# EAGLE design BMS-banana-rev1-0 (EAGLE 9.6.2)
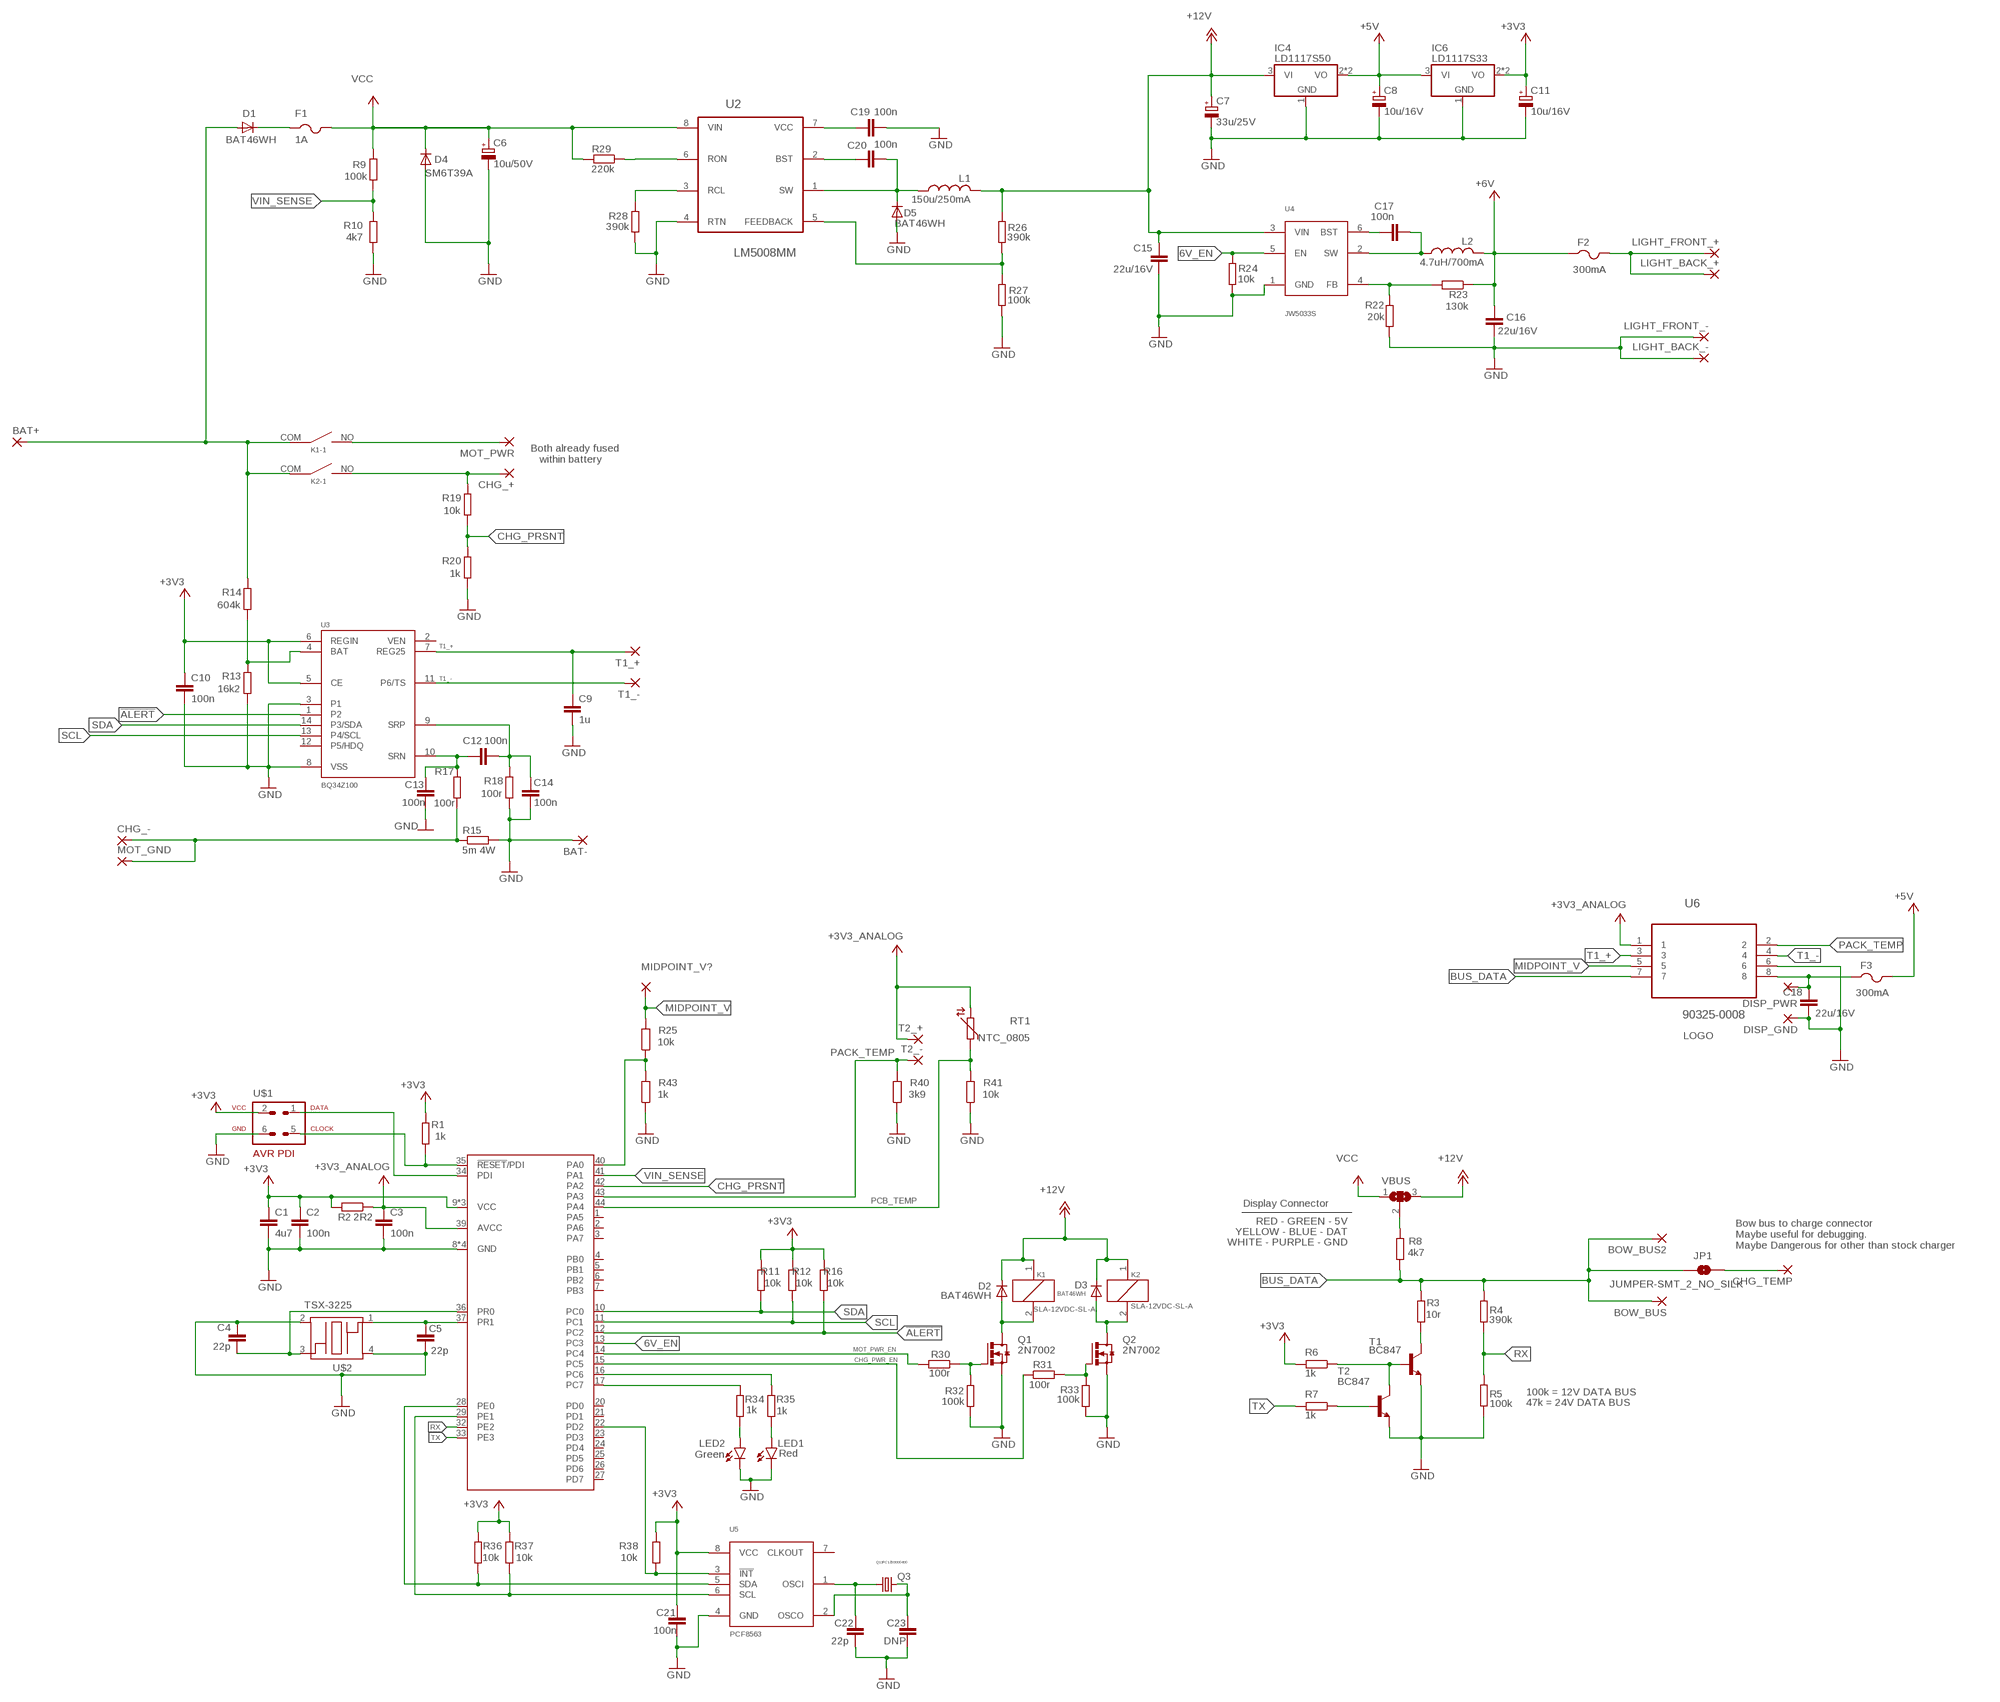
[diagram p0: schematic, sheet 1]

## Parts
BAT+  3,81/2,1  [3,81/2,1]
BAT-  3,81/2,1  [3,81/2,1]
BOW_BUS  3,81/2,1  [3,81/2,1]
BOW_BUS2  2,54/0,8  [2,54/0,8]
C1  4u7  C-EUC0805  [C0805]
C2  100n  C-EUC0805  [C0805]
C3  100n  C-EUC0805  [C0805]
C4  22p  C-EUC0805  [C0805]
C5  22p  C-EUC0805  [C0805]
C6  10u/50V  CPOL-EU153CLV-0605  [153CLV-0605]
C7  33u/25V  CPOL-EU153CLV-0605  [153CLV-0605]
C8  10u/16V  CPOL-EU153CLV-0405  [153CLV-0405]
C9  1u  C-EUC0805  [C0805]
C10  100n  C-EUC0805  [C0805]
C11  10u/16V  CPOL-EU153CLV-0405  [153CLV-0405]
C12  100n  C-EUC0805  [C0805]
C13  100n  C-EUC0805  [C0805]
C14  100n  C-EUC0805  [C0805]
C15  22u/16V  C-EUC0805  [C0805]
C16  22u/16V  C-EUC0805  [C0805]
C17  100n  C-EUC0805  [C0805]
C18  22u/16V  C-EUC0805  [C0805]
C19  100n  C-EUC0805  [C0805]
C20  100n  C-EUC0805  [C0805]
C21  100n  C-EUC0805  [C0805]
C22  22p  C-EUC0805  [C0805]
C23  DNP  C-EUC0805  [C0805]
CHG_+  3,81/2,1  [3,81/2,1]
CHG_-  3,81/2,1  [3,81/2,1]
CHG_TEMP  3,81/2,1  [3,81/2,1]
D1  BAT46WH  DIODE-SMB  [SMB]
D2  BAT46WH  DIODE-SMB  [SMB]
D3  BAT46WH  DIODE-SMB  [SMB]
D4  SM6T39A  DIODE-SMB  [SMB]
D5  BAT46WH  DIODE-SOD323-W  [SOD323-W]
DISP_GND  2,54/0,8  [2,54/0,8]
DISP_PWR  2,54/0,8  [2,54/0,8]
F1  1A  PTCFUSE-1812  [1812]
F2  300mA  PTCFUSE-1812  [1812]
F3  300mA  PTCFUSE-1812  [1812]
IC4  LD1117S50  LM340ST-ST  [SOT223]
IC6  LD1117S33  LM340ST-ST  [SOT223]
JP1  JUMPER-SMT_2_NO_SILK  [SMT-JUMPER_2_NO_SILK]
K1  SLA-12VDC-SL-A  [SLA-12VDC-SL-A]
K2  SLA-12VDC-SL-A  [SLA-12VDC-SL-A]
L1  150u/250mA  L-USWE-TPC  [POWER-CHOKE_WE-TPC]
L2  4.7uH/700mA  L_0805  [L0805]
LED1  Red  LEDCHIPLED_0805  [CHIPLED_0805]
LED2  Green  LEDCHIPLED_0805  [CHIPLED_0805]
LIGHT_BACK_+  2,54/0,8  [2,54/0,8]
LIGHT_BACK_-  2,54/0,8  [2,54/0,8]
LIGHT_FRONT_+  2,54/0,8  [2,54/0,8]
LIGHT_FRONT_-  2,54/0,8  [2,54/0,8]
MIDPOINT_V?  2,54/0,8  [2,54/0,8]
MOT_GND  3,81/2,1  [3,81/2,1]
MOT_PWR  3,81/2,1  [3,81/2,1]
Q1  2N7002  [SOT-23]
Q2  2N7002  [SOT-23]
Q3  Q13FC1350000400  [CRYSTAL_3215]
R1  1k  R-EU_R0805  [R0805]
R2  2R2  R-EU_R0805  [R0805]
R3  10r  R-EU_R0805  [R0805]
R4  390k  R-EU_R0805  [R0805]
R5  100k  R-EU_R0805  [R0805]
R6  1k  R-EU_R0805  [R0805]
R7  1k  R-EU_R0805  [R0805]
R8  4k7  R-EU_R0805  [R0805]
R9  100k  R-EU_R0805  [R0805]
R10  4k7  R-EU_R0805  [R0805]
R11  10k  R-EU_R0805  [R0805]
R12  10k  R-EU_R0805  [R0805]
R13  16k2  R-EU_R0805  [R0805]
R14  604k  R-EU_R0805  [R0805]
R15  5m 4W  SHUNT_2728  [R2728]
R16  10k  R-EU_R0805  [R0805]
R17  100r  R-EU_R0805  [R0805]
R18  100r  R-EU_R0805  [R0805]
R19  10k  R-EU_R0805  [R0805]
R20  1k  R-EU_R0805  [R0805]
R22  20k  R-EU_R0805  [R0805]
R23  130k  R-EU_R0805  [R0805]
R24  10k  R-EU_R0805  [R0805]
R25  10k  R-EU_R0805  [R0805]
R26  390k  R-EU_R0805  [R0805]
R27  100k  R-EU_R0805  [R0805]
R28  390k  R-EU_R0805  [R0805]
R29  220k  R-EU_R0805  [R0805]
R30  100r  R-EU_R0805  [R0805]
R31  100r  R-EU_R0805  [R0805]
R32  100k  R-EU_R0805  [R0805]
R33  100k  R-EU_R0805  [R0805]
R34  1k  R-EU_R0805  [R0805]
R35  1k  R-EU_R0805  [R0805]
R36  10k  R-EU_R0805  [R0805]
R37  10k  R-EU_R0805  [R0805]
R38  10k  R-EU_R0805  [R0805]
R40  3k9  R-EU_R0805  [R0805]
R41  10k  R-EU_R0805  [R0805]
R43  1k  R-EU_R0805  [R0805]
RT1  NTC_0805  [R0805]
T1  BC847  [SOT23]
T1_+  2,54/0,8  [2,54/0,8]
T1_-  2,54/0,8  [2,54/0,8]
T2  BC847  [SOT23]
T2_+  2,54/0,8  [2,54/0,8]
T2_-  2,54/0,8  [2,54/0,8]
U1  ATXMEGA32A4U-AU  [TQFP-44A-44]
U2  LM5008MM  [SOP65P490X109-8N]
U3  BQ34Z100  [PW_R-PDSO-G14]
U4  JW5033S  [SOT23-6]
U5  PCF8563  [SO08]
U6  90325-0008  [MOLEX_90325-0008]
U$1  AVR-PDIVERT  [AVR-ISP-6]
U$2  TSX-3225  [TSX-3225]
U$4  AFROBOTICLOGOAFROBOTICLOGO_SMALL  [AFROBOTICLOGOSMALL]
VBUS  SJ2W  [SJ_2]

## Nets
6V_EN: R24.2 U1.13(PC3) U4.5(EN)
!ALERT: R16.1 U1.12(PC2) U3.1(P2)
+3V3: C1.1 C2.1 C10.1 C11.+ C21.2 IC6.2(VO) IC6.4(VO) R1.2 R2.2 R6.2 R11.2 R12.2 R16.2 R36.2 R37.2 R38.2 U1.9(VCC) U1.19(VCC) U1.31(VCC) U3.5(CE) U3.6(REGIN) U5.8(VCC) U$1.2
+3V3_ANALOG: C3.1 R2.1 RT1.2 T2_+.1(P) U1.39(AVCC) U6.1
+5V: C8.+ F3.2 IC4.2(VO) IC4.4(VO) IC6.3(VI)
+6V: C16.2 F2.1 L2.2 R23.1
+12V: C7.+ C15.2 D2.C D3.C IC4.3(VI) K1.1 K2.1 L1.2 R26.2 U4.3(VIN) VBUS.3
BUS_DATA: BOW_BUS2.1(P) BOW_BUS.1(P) JP1.1 R3.2 R4.2 R8.1 U6.7
CHG_PRSNT: R19.1 R20.2 U1.42(PA2)
CHG_PWR_EN: R31.1 U1.15(PC5)
GND: BAT-.1(P) C1.2 C2.2 C3.2 C4.1 C5.2 C6.- C7.- C8.- C9.2 C10.2 C11.- C13.1 C14.1 C15.1 C16.1 C18.1 C19.2 C21.1 C22.1 C23.1 D4.A D5.A DISP_GND.1(P) IC4.1(GND) IC6.1(GND) LED1.C LED2.C LIGHT_BACK_-.1(P) LIGHT_FRONT_-.1(P) Q1.2(S) Q2.2(S) R5.1 R10.1 R13.1 R15.P$2 R18.1 R20.1 R22.1 R24.1 R27.1 R28.1 R32.2 R33.2 R40.1 R41.1 R43.1 T1.2(E) T2.2(E) U1.8(GND) U1.18(GND) U1.30(GND) U1.38(GND) U2.4(RTN) U3.3(P1) U3.8(VSS) U4.1(GND) U5.4(GND) U6.6 U$1.6 U$2.2(GND_2) U$2.4(GND_4)
MIDPOINT_V: MIDPOINT_V?.1(P) R25.2 U6.5
MOT_PWR_EN: R30.2 U1.14(PC4)
N$1: R1.1 U1.35(!RESET!/PDI) U$1.5
N$2: U1.34(PDI) U$1.1
N$3: D1.C F1.1
N$4: C5.1 U1.37(PR1) U$2.1(XTALIN)
N$5: C4.2 U1.36(PR0) U$2.3(XTALOUT)
N$6: R8.2 VBUS.2
N$7: C19.1 U2.7(VCC)
N$8: R13.2 R14.1 U3.4(BAT)
N$10: R22.2 R23.2 U4.4(FB)
N$11: CHG_-.1(P) MOT_GND.1(P) R15.P$1 R17.1
N$12: R3.1 T1.3(C)
N$14: C12.1 C13.2 R17.2 U3.10(SRN)
N$15: CHG_+.1(P) K2.NO(-1:NO) R19.2
N$16: C12.2 C14.2 R18.2 U3.9(SRP)
N$17: C20.1 U2.2(BST)
N$18: K1.NO(-1:NO) MOT_PWR.1(P)
N$19: CHG_TEMP.1(P) JP1.2
N$20: F2.2 LIGHT_BACK_+.1(P) LIGHT_FRONT_+.1(P)
N$21: C18.2 DISP_PWR.1(P) F3.1 U6.8
N$22: C20.2 D5.C L1.1 U2.1(SW)
N$23: R7.1 T2.1(B)
N$24: R26.1 R27.2 U2.5(FEEDBACK)
N$25: R6.1 T1.1(B) T2.3(C)
N$26: C17.1 U4.6(BST)
N$27: R28.2 U2.3(RCL)
N$28: C17.2 L2.1 U4.2(SW)
N$29: R25.1 R43.2 U1.40(PA0)
N$30: R29.1 U2.6(RON)
N$31: Q1.1(G) R30.1 R32.1
N$32: D2.A K1.2 Q1.3(D)
N$33: R38.1 U1.22(PD2) U5.3(!INT)
N$34: D3.A K2.2 Q2.3(D)
N$35: Q2.1(G) R31.2 R33.1
N$36: LED2.A R34.1
N$37: R37.1 U1.29(PE1) U5.6(SCL)
N$38: LED1.A R35.1
N$39: R35.2 U1.16(PC6)
N$40: R34.2 U1.17(PC7)
N$41: R36.1 U1.28(PE0) U5.5(SDA)
N$42: C22.2 Q3.P$1 U5.1(OSCI)
N$43: C23.2 Q3.P$2 U5.2(OSCO)
PACK_TEMP: R40.2 T2_-.1(P) U1.43(PA3) U6.2
PCB_TEMP: R41.2 RT1.1 U1.44(PA4)
RX: R4.1 R5.2 U1.32(PE2)
SCL: R12.1 U1.11(PC1) U3.13(P4/SCL)
SDA: R11.1 U1.10(PC0) U3.14(P3/SDA)
T1_+: C9.1 T1_+.1(P) U3.7(REG25) U6.3
T1_-: T1_-.1(P) U3.11(P6/TS) U6.4
TX: R7.2 U1.33(PE3)
VBAT: BAT+.1(P) D1.A K1.COM(-1:COM) K2.COM(-1:COM) R14.2
VCC: C6.+ D4.C F1.2 R9.2 R29.2 U2.8(VIN) VBUS.1
VIN_SENSE: R9.1 R10.2 U1.41(PA1)
Unconnected: U1.1(PA5) U1.2(PA6) U1.3(PA7) U1.4(PB0) U1.5(PB1) U1.6(PB2) U1.7(PB3) U1.20(PD0) U1.21(PD1) U1.23(PD3) U1.24(PD4) U1.25(PD5) U1.26(PD6) U1.27(PD7) U3.2(VEN) U3.12(P5/HDQ) U5.7(CLKOUT)

## Notes on the sheet
- Both already fused
     within battery
- Display Connector
- RED - GREEN - 5V
- YELLOW - BLUE - DAT
- WHITE - PURPLE - GND
- Bow bus to charge connector
  Maybe useful for debugging.
  Maybe Dangerous for other than stock charger
- 100k = 12V DATA BUS
- 47k = 24V DATA BUS

## Library data of the parts
BAT+ BAT- BOW_BUS CHG_+ CHG_- CHG_TEMP MOT_GND MOT_PWR = thierry:3,81/2,1: THROUGH-HOLE PAD
BOW_BUS2 DISP_GND DISP_PWR LIGHT_BACK_+ LIGHT_BACK_- LIGHT_FRONT_+ LIGHT_FRONT_- MIDPOINT_V? T1_+ T1_- T2_+ T2_- = thierry:2,54/0,8: THROUGH-HOLE PAD
C1-C5 C9 C10 C12-C23 = rcl:C-EU: CAPACITOR, European symbol; SPICEPREFIX: C
C6-C8 C11 = rcl:CPOL-EU: POLARIZED CAPACITOR, European symbol
D1-D3 = diode:DIODE-: DIODE; FARNELL: 2069340
D4 = diode:DIODE-: DIODE; FARNELL: 9802703
D5 = diode:DIODE-: DIODE
F1-F3 = adafruit:PTCFUSE: PTC fuses, resettable thermistors
IC4 = linear:LM340?-*: Positive VOLTAGE REGULATOR Source: http://cache.national.com/ds/LM/LM340.pdf; FARNELL: 1467780
IC6 = linear:LM340?-*: Positive VOLTAGE REGULATOR Source: http://cache.national.com/ds/LM/LM340.pdf
JP1 = SparkFun-Jumpers:JUMPER-SMT_2_NO: Normally open jumper This jumper has two pads in close proximity to each other. Apply solder to close the connection. Round pads are easier to solder for beginners, but are a lot larger. SparkFun Product that uses the round pads: SparkFun EL Sequencer <https://www.sparkfun.com/products/12781>
K1 K2 = thierry:SLA-12VDC-SL-A; LSCS: C55194
L1 = rcl:L-US: INDUCTOR, American symbol
L2 = thierry:L_0805
LED1 LED2 = led:LED: LED OSRAM: - CHIPLED LG R971, LG N971, LY N971, LG Q971, LY Q971, LO R971, LY R971 LH N974, LH R974 LS Q976, LO Q976, LY Q976 LO Q996 - Hyper CHIPLED LW Q18S LB Q993, LB Q99A, LB R99A - SideLED LS A670, LO A670, LY A670, LG A670, LP A670 LB A673, LV A673, LT A673, LW A673 LH A674 LY A675 LS A676, LA A676, LO A676, LY A676, LW A676 LS A679, LY A679, LG A679 - Hyper Micro SIDELED® LS Y876, LA Y876, LO Y876, LY Y876 LT Y87S - SmartLED LW L88C, LW L88S LB L89C, LB L89S, LG L890 LS L89K, LO L89K, LY L89K LS L896, LA L896, LO L896, LY L896 - TOPLED LS T670, LO T670, LY T670, LG T670, LP T670 LSG T670, LSP T670, LSY T670, LOP T670, LYG T670 LG T671, LOG T671, LSG T671 LB T673, LV T673, LT T673, LW T673 LH T674 LS T676, LA T676, LO T676, LY T676, LB T676, LH T676, LSB T676, LW T676 LB T67C, LV T67C, LT T67C, LS T67K, LO T67K, LY T67K, LW E67C LS E67B, LA E67B, LO E67B, LY E67B, LB E67C, LV E67C, LT E67C LW T67C LS T679, LY T679, LG T679 LS T770, LO T770, LY T770, LG T770, LP T770 LB T773, LV T773, LT T773, LW T773 LH T774 LS E675, LA E675, LY E675, LS T675 LS T776, LA T776, LO T776, LY T776, LB T776 LHGB T686 LT T68C, LB T68C - Hyper Mini TOPLED® LB M676 - Mini TOPLED Santana® LG M470 LS M47K, LO M47K, LY M47K Source: http://www.osram.convergy.de LUXEON: - LUMILED® LXK2-PW12-R00, LXK2-PW12-S00, LXK2-PW14-U00, LXK2-PW14-V00 LXK2-PM12-R00, LXK2-PM12-S00, LXK2-PM14-U00 LXK2-PE12-Q00, LXK2-PE12-R00, LXK2-PE12-S00, LXK2-PE14-T00, LXK2-PE14-U00 LXK2-PB12-K00, LXK2-PB12-L00, LXK2-PB12-M00, LXK2-PB14-N00, LXK2-PB14-P00, LXK2-PB14-Q00 LXK2-PR12-L00, LXK2-PR12-M00, LXK2-PR14-Q00, LXK2-PR14-R00 LXK2-PD12-Q00, LXK2-PD12-R00, LXK2-PD12-S00 LXK2-PH12-R00, LXK2-PH12-S00 LXK2-PL12-P00, LXK2-PL12-Q00, LXK2-PL12-R00 Source: www.luxeon.com KINGBRIGHT: KA-3528ASYC Source: www.kingbright.com
Q1 Q2 = thierry:2N7002
Q3 = thierry:Q13FC1350000400; LCSC: C32346
R1-R14 R16-R20 R22-R38 R40 R41 R43 = rcl:R-EU_: RESISTOR, European symbol; SPICEPREFIX: R
R15 = thierry:SHUNT_2728
RT1 = thierry:NTC_0805
T1 T2 = transistor:BC847: NPN TRANSISTOR
U1 = atmel-xmega:ATXMEGA32A4U: 8/16-bit XMEGA A4U Microcontroller Features High-performance, low-power Atmel® AVR® XMEGA® 8/16-bit Microcontroller Nonvolatile program and data memories – 16K - 128KBytes of in-system self-programmable flash – 4K - 8KBytes boot section – 1K - 2KBytes EEPROM – 2K - 8KBytes internal SRAM Peripheral Features – Four-channel DMA controller – Eight-channel event system – Five 16-bit timer/counters Three timer/counters with 4 output compare or input capture channels Two timer/counters with 2 output compare or input capture channels High-resolution extensions on all timer/counters Advanced waveform extension (AWeX) on one timer/counter – One USB device interface USB 2.0 full speed (12Mbps) and low speed (1.5Mbps) device compliant 32 Endpoints with full configuration flexibility – Five USARTs with IrDA support for one USART – Two Two-wire interfaces with dual address match (I2C and SMBus compatible) – Two serial peripheral interfaces (SPIs) – AES and DES crypto engine – CRC-16 (CRC-CCITT) and CRC-32 (IEEE® 802.3) generator – 16-bit real time counter (RTC) with separate oscillator – One twelve-channel, 12-bit, 2mspsAnalog to Digital Converter – One two-channel, 12-bit, 1msps Digital to Analog Converter – Two Analog Comparators with window compare function, and current sources – External interrupts on all general purpose I/O pins – Programmable watchdog timer with separate on-chip ultra low power oscillator – QTouch® library support Capacitive touch buttons, sliders and wheels Special microcontroller features – Power-on reset and programmable brown-out detection – Internal and external clock options with PLL and prescaler – Programmable multilevel interrupt controller – Five sleep modes – Programming and debug interfaces PDI (program and debug interface) I/O and packages – 34 Programmable I/O pins – 44 - lead TQFP – 44 - pad VQFN/QFN – 49 - ball VFBGA Operating voltage – 1.6 – 3.6V Operating frequency – 0 – 12MHz from 1.6V – 0 – 32MHz from 2.7V
U2 = components:LM5008MM: Step-Down Switching Regulator; MPN: LM5008MM; OC_FARNELL: 8181721; OC_NEWARK: 38K3760; PACKAGE: SOP-8; SUPPLIER: National Semiconductor
U3 = borkedlabs-powerics:BQ34Z100
U4 = thierry:JW5033S; LCSC: C324577
U5 = thierry:PCF8563; LCSC: C7440
U6 = Molex_By_element14_Batch_1:90325-0008: HEADER; MPN: 90325-0008; OC_FARNELL: 673237; OC_NEWARK: 46WX960; PACKAGE: HEADER, 1.27MM, 8 WAY; SUPPLIER: Molex
U$1 = avr-7:AVR-PDI: AVR PDI programming interface connector
U$2 = crystals:TSX-3225
U$4 = thierry:AFROBOTICLOGO
VBUS = jumper:SJ2W: SMD solder JUMPER

## Board
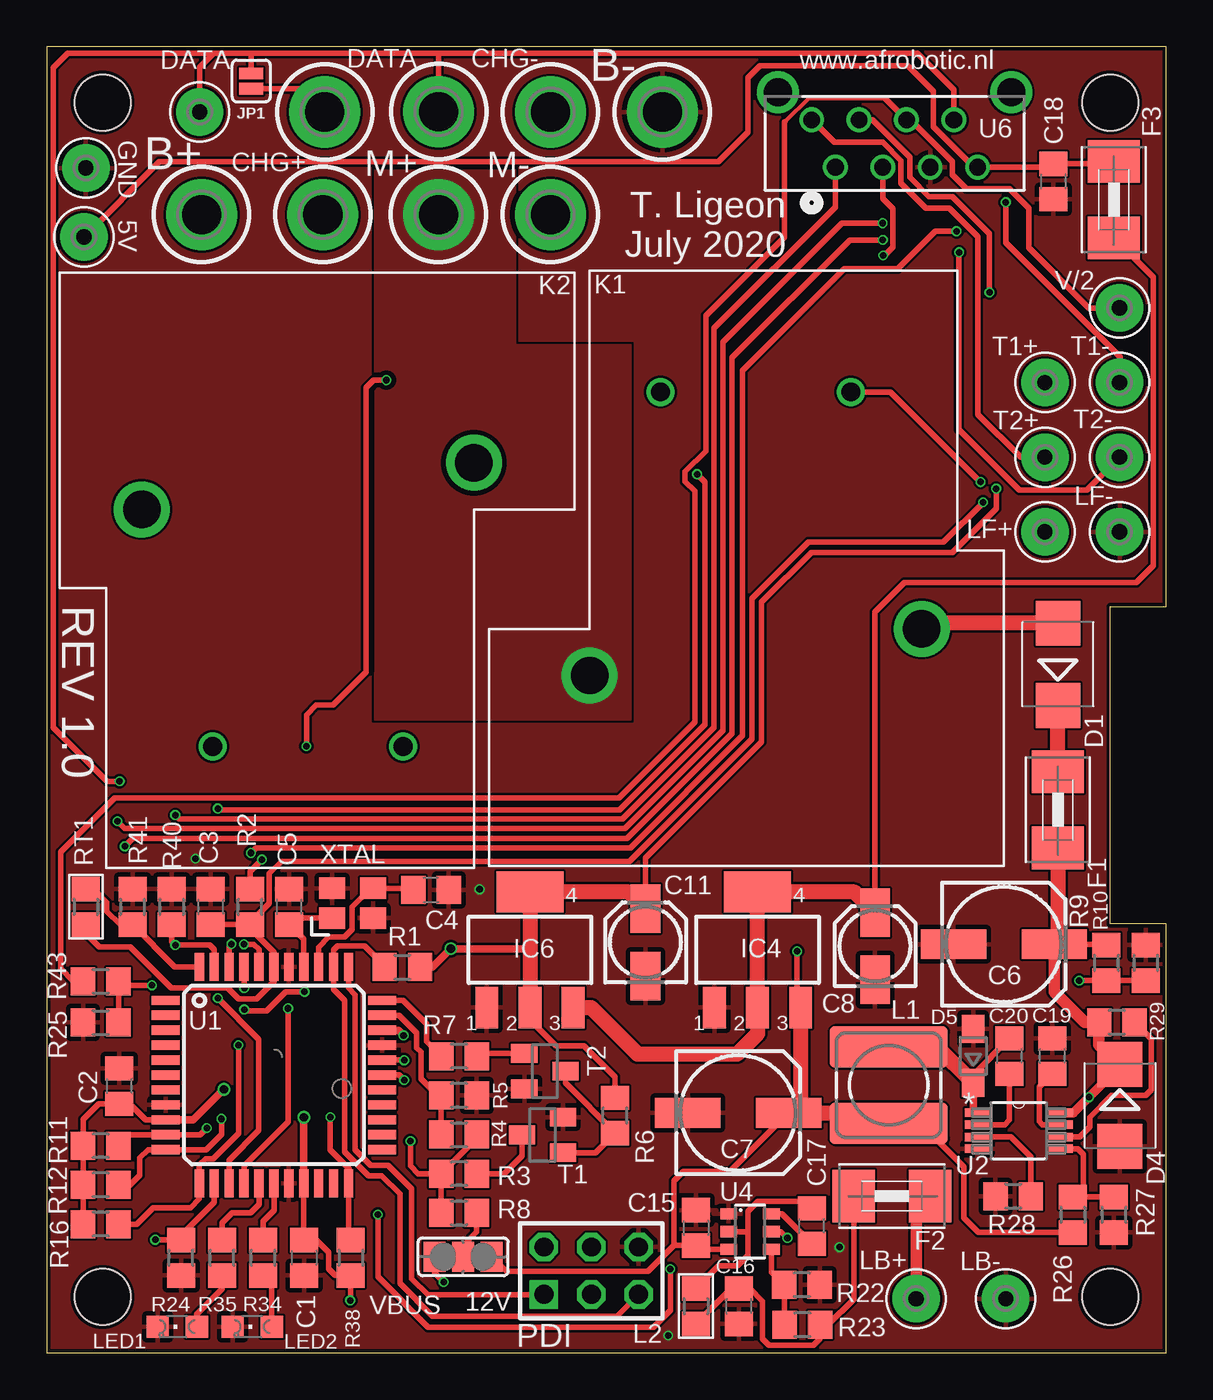
[diagram p1: board, top side]
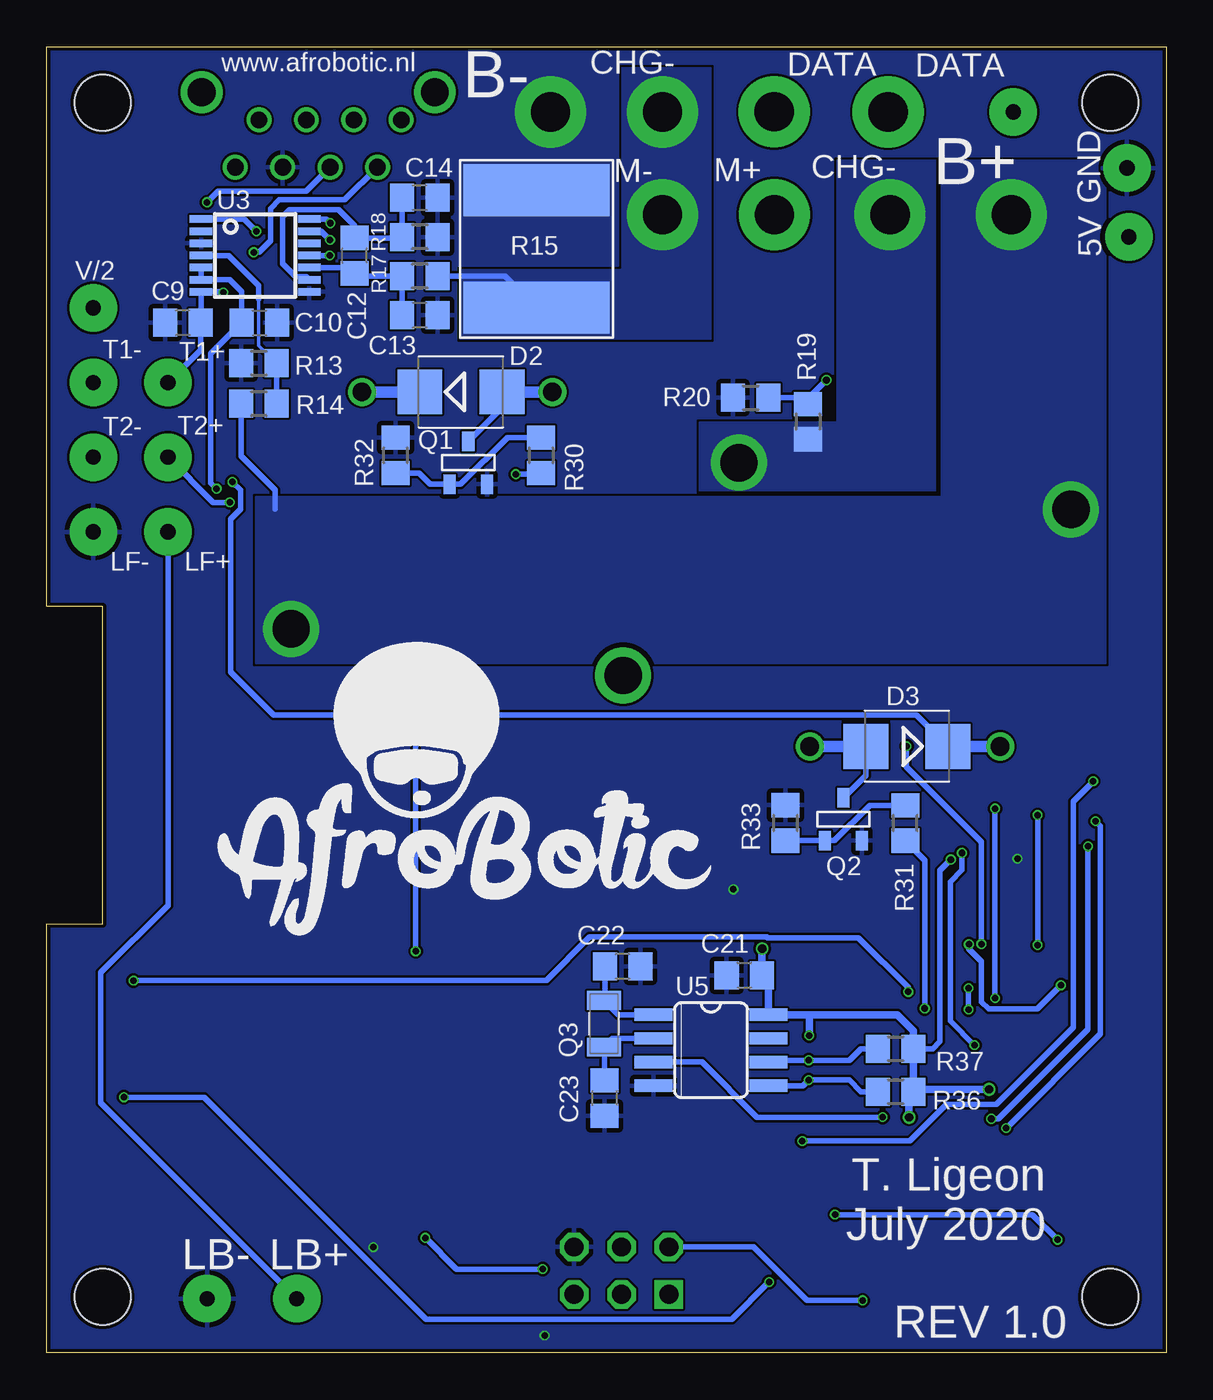
[diagram p2: board, bottom side, seen from below]

Size 60 x 70 mm. Coordinates in mm from the lower left corner, seen from the top.
Outline: 0,0 60,0 60,23 57,23 57,40 60,40 60,70 0,70 0,0
Copper layers (1*16): Top 0.035559375mm / dielectric 1.6mm / Bottom 0.035559375mm
Design rules "jlcpcb2layer": minimum track width 5mil, minimum drill 12mil, track to track 5mil, track to pad 5mil, pad to pad 5mil, via to via 5mil, smd to smd 5mil, copper to edge 8mil, drill to drill 6mil, minimum pad ring 5mil, minimum via ring 3mil, stop-mask expansion 2.5mil, vias tented up to drill 0mil, thermal gap 10mil
Holes 3 mm at 57,3 57,67 3,67 3,3

### Footprints (pad centres in the part's own frame; a part is rotated, then mirrored left to right if it is on the bottom)
3,81/2,1 = drill 2.1 pad 3.81: 1 0,0
2,54/0,8 = drill 0.813 pad 2.54: 1 0,0
C0805 = smd 1.3 x 1.5: 1 -0.95,0; 2 0.95,0
153CLV-0605 = smd 3.5 x 1.6: + 2.7,0; - -2.7,0
153CLV-0405 = smd 2.6 x 1.6: + 1.8,0; - -1.8,0
SMB = smd 2.4 x 2.4: A 2.2,0; C -2.2,0
SOD323-W = smd 1.5 x 1.2: A 1.45,0; C -1.45,0
1812 = smd 2.286 x 2.794: 1 -2.046,0; 2 2.046,0
SOT223 = smd 1.219 x 2.235: 1 -2.311,-3.099; 2 0,-3.099; 3 2.311,-3.099 | smd 3.6 x 2.2: 4 0,3.099
SMT-JUMPER_2_NO_SILK = smd 0.635 x 1.27: 1 -0.406,0; 2 0.406,0
SLA-12VDC-SL-A = drill 1: 1 -5.1,6.5; 2 5.1,6.5 | drill 2: COM -8.9,19.2; NO 8.9,21.7
POWER-CHOKE_WE-TPC = smd 6.3 x 2.2: 1 0,2.05; 2 0,-2.05
L0805 = smd 1.3 x 1.5: 1 -0.95,0; 2 0.95,0
CHIPLED_0805 = smd 1.2 x 1.2: A 0,-1.05; C 0,1.05
SOT-23 = smd 0.65 x 1.05: 1 -1,-1.15; 2 1,-1.15; 3 0,1.15
CRYSTAL_3215 = smd 1 x 1.8: P$1 -1.25,0; P$2 1.25,0
R0805 = smd 1.3 x 1.5: 1 -0.95,0; 2 0.95,0
R2728 = smd 2.8 x 7.8: P$1 0,0; P$2 6.3,0
SOT23 = smd 1 x 1.4: 1 -0.95,-1.1; 2 0.95,-1.1; 3 0,1.1
TQFP-44A-44 = smd 1.5 x 0.5: 1 -5.8,4; 2 -5.8,3.2; 3 -5.8,2.4; 4 -5.8,1.6; 5 -5.8,0.8; 6 -5.8,0; 7 -5.8,-0.8; 8 -5.8,-1.6; 9 -5.8,-2.4; 10 -5.8,-3.2; 11 -5.8,-4; 23 5.8,-4; 24 5.8,-3.2; 25 5.8,-2.4; 26 5.8,-1.6; 27 5.8,-0.8; 28 5.8,0; 29 5.8,0.8; 30 5.8,1.6; 31 5.8,2.4; 32 5.8,3.2; 33 5.8,4 | smd 0.5 x 1.5: 12 -4,-5.8; 13 -3.2,-5.8; 14 -2.4,-5.8; 15 -1.6,-5.8; 16 -0.8,-5.8; 17 0,-5.8; 18 0.8,-5.8; 19 1.6,-5.8; 20 2.4,-5.8; 21 3.2,-5.8; 22 4,-5.8; 34 4,5.8; 35 3.2,5.8; 36 2.4,5.8; 37 1.6,5.8; 38 0.8,5.8; 39 0,5.8; 40 -0.8,5.8; 41 -1.6,5.8; 42 -2.4,5.8; 43 -3.2,5.8; 44 -4,5.8
SOP65P490X109-8N = smd 1.372 x 0.457: 1 -2.21,0.965; 2 -2.21,0.33; 3 -2.21,-0.33; 4 -2.21,-0.965; 5 2.21,-0.965; 6 2.21,-0.33; 7 2.21,0.33; 8 2.21,0.965
PW_R-PDSO-G14 = smd 0.4 x 1.2: 1 -1.95,-2.9; 2 -1.3,-2.9; 3 -0.65,-2.9; 4 0,-2.9; 5 0.65,-2.9; 6 1.3,-2.9; 7 1.95,-2.9; 8 1.95,2.9; 9 1.3,2.9; 10 0.65,2.9; 11 0,2.9; 12 -0.65,2.9; 13 -1.3,2.9; 14 -1.95,2.9
SOT23-6 = smd 0.6 x 0.9: 1 -0.95,-1.15; 2 0,-1.15; 3 0.95,-1.15; 4 0.95,1.15; 5 0,1.15; 6 -0.95,1.15
SO08 = smd 0.66 x 2.032: 1 -1.905,-3.073; 2 -0.635,-3.073; 3 0.635,-3.073; 4 1.905,-3.073; 5 1.905,3.073; 6 0.635,3.073; 7 -0.635,3.073; 8 -1.905,3.073
MOLEX_90325-0008 = drill 0.889: 1 0,5.08; 2 1.27,2.54; 3 2.54,5.08; 4 3.81,2.54; 5 5.08,5.08; 6 6.35,2.54; 7 7.62,5.08; 8 8.89,2.54 | drill 1.499: 9 -1.803,6.553; 10 10.693,6.553
AVR-ISP-6 = drill 1.016 square: 1 -2.54,-1.27 | drill 1.016 octagon: 2 -2.54,1.27; 3 0,-1.27; 4 0,1.27; 5 2.54,-1.27; 6 2.54,1.27
TSX-3225 = smd 1.4 x 1.15: 1 0,-1.6; 2 2.2,-1.6; 3 2.2,0; 4 0,0
SJ_2 = smd 1.168 x 1.6: 1 -1.524,0; 2 0,0; 3 1.524,0

### Placement (x,y rotation side)
BAT+  8.3,61 0 top
BAT-  33,66.5 0 top
BOW_BUS  21.01,66.52 0 top
BOW_BUS2  8.2,66.5 0 top
C1  13.8,5.1 270 top
C2  3.9,14.3 90 top
C3  8.8,23.9 90 top
C4  20.6,24.8 180 top
C5  13,23.9 90 top
C6  51.3,21.9 0 top
C7  37.06,12.87 0 top
C8  44.4,21.8 90 top
C9  52.7,55.2 180 bottom
C10  48.6,55.2 0 bottom
C11  32.1,22 90 top
C12  43.5,58.8 90 bottom
C13  40,55.6 180 bottom
C14  40,61.9 180 bottom
C15  34.8,6.7 270 top
C16  37.1,2.5 90 top
C17  41,6.8 90 top
C18  53.96,62.77 90 top
C19  53.9,15.9 90 top
C20  51.6,15.9 90 top
C21  22.61,20.24 0 bottom
C22  29.13,20.71 180 bottom
C23  30.09,13.65 90 bottom
CHG_+  14.8,61 0 top
CHG_-  27,66.5 0 top
CHG_TEMP  14.9,66.5 0 top
D1  54.2,36.9 90 top
D2  37.8,51.5 0 bottom
D3  13.9,32.5 180 bottom
D4  57.52,13.26 270 top
D5  49.66,15.91 90 top
DISP_GND  2.1,63.5 0 top
DISP_PWR  2,59.8 0 top
F1  54.2,29.1 270 top
F2  45.3,8.4 0 top
F3  57.2,61.8 270 top
IC4  38.1,21.6 0 top
IC6  25.9,21.6 0 top
JP1  10.96,68.16 270 top
K1  38,58 180 top
K2  14,26 0 top
L1  45.13,14.35 0 top
L2  34.8,2.5 270 top
LED1  7,1.4 90 top
LED2  11.02,1.4 90 top
LIGHT_BACK_+  46.6,2.9 0 top
LIGHT_BACK_-  51.4,2.9 0 top
LIGHT_FRONT_+  53.5,44 0 top
LIGHT_FRONT_-  57.5,44 0 top
MIDPOINT_V?  57.5,56 0 top
MOT_GND  27,61 0 top
MOT_PWR  21,61 0 top
Q1  37.4,47.7 0 bottom
Q2  17.3,28.6 0 bottom
Q3  30.13,17.64 270 bottom
R1  19.06,20.67 0 top
R2  10.9,23.9 90 top
R3  22.1,9.6 180 top
R4  22.1,11.7 0 top
R5  22.1,13.8 180 top
R6  30.46,12.72 90 top
R7  22.1,15.9 180 top
R8  22.1,7.5 0 top
R9  56.8,20.9 90 top
R10  58.9,20.9 270 top
R11  2.9,11.1 180 top
R12  2.9,9 180 top
R13  48.63,53.04 0 bottom
R14  48.62,50.86 180 bottom
R15  33.75,56.01 90 bottom
R16  2.9,6.9 180 top
R17  40,57.7 180 bottom
R18  40,59.8 180 bottom
R19  19.2,49.9 270 bottom
R20  22.27,51.18 0 bottom
R22  40.48,3.65 180 top
R23  40.5,1.5 180 top
R24  7.2,5.1 90 top
R25  2.9,19.9 180 top
R26  55,7.4 270 top
R27  57.2,7.4 90 top
R28  51.8,8.4 0 top
R29  57.36,17.71 180 top
R30  33.5,48.1 270 bottom
R31  13.99,28.39 90 bottom
R32  41.3,48.1 90 bottom
R33  20.4,28.4 90 bottom
R34  11.6,5.1 90 top
R35  9.4,5.1 90 top
R36  14.5,14 0 bottom
R37  14.5,16.3 0 bottom
R38  16.3,5.1 270 top
R40  6.7,23.9 270 top
R41  4.6,23.9 270 top
R43  2.9,17.7 0 top
RT1  2.1,23.9 270 top
T1  26.58,11.68 90 top
T1_+  53.5,52 0 top
T1_-  57.5,52 0 top
T2  26.7,15.1 270 top
T2_+  53.5,48 0 top
T2_-  57.5,48 0 top
U1  12.18,14.89 0 top
U2  52.1,11.9 0 top
U3  48.83,58.81 270 bottom
U4  37.7,6.5 270 top
U5  24.4,16.22 270 bottom
U6  41,61 0 top
U$1  29.19,4.4 0 top
U$2  15.3,24.9 0 top
U$4  50.83,22.38 0 bottom
VBUS  22.32,5.15 0 top

### Tracks (layer width: path | path; a pad name or v marks a point on that pad's centre or on a via)
6V_EN  (via drill 0.35)
  Top 0.305: U1.13 8.98,8.08 7.2,6.3 R24.2 | R24.2 | U4.5 39.36,6.5 v39.7,6.16 | v33.42,4.49 33.42,2.28 32.52,1.38 20.44,1.38 17.75,4.07 v17.75,7.41 | v5.82,6.06 R24.2
  Bottom 0.305: v39.7,6.16 38.03,4.49 v33.42,4.49 | v17.75,7.41 7.17,7.41 v5.82,6.06
!ALERT  (via drill 0.35)
  Top 0.305: R16.1 4.83,6.9 5.71,7.78 7.71,7.78 8.18,8.25 U1.12 8.18,10.07 8.52,10.41 8.93,10.41 10.28,11.76 v10.28,16.49 | v48.76,60.11 47.63,60.11 45.62,58.1 42.75,58.1 37.3,52.65 37.3,33.08 31.29,27.07 11.23,27.07 v10.95,26.79
  Bottom 0.305: U3.1 49.41,60.76 v48.76,60.11 | v10.95,26.79 10.95,25.88 11.58,25.25 11.58,17.79 v10.28,16.49
+3V3  (via drill 0.35, 0.45)
  Top 0.305: R16.2 R12.2 R11.2 1.95,12.51 2.79,13.35 C2.1 4.44,13.35 5.3,12.49 U1.9 | U1.19 13.78,6.07 C1.1 14.44,6.05 15.1,5.39 15.1,4.51 15.46,4.15 R38.2 16.3,2.84 v16.27,2.81 | v50.89,46.31 50.89,45.25 48.54,42.9 40.99,42.9 38.32,40.23 38.32,32.73 32.1,26.51 C11.+ | R6.2 30.46,14.79 28.8,16.45 27.29,16.45 25.9,17.84 IC6.2 | v11.54,26.44 10.9,25.8 R2.2
  Top 0.406: 25.9,21.56 25.8,21.66 v21.66,21.66 20.67,20.67 R1.2 | U1.9 7.86,12.49 v9.49,14.12 | U1.19 v13.78,12.62 | v19.13,17.01 18.85,17.29 U1.31
  Top 0.813: C11.+ 31.2,24.7 IC6.4 25.9,21.56 IC6.2
  Bottom 0.305: U3.5 U3.6 50.2,57.51 49.55,56.86 C10.1 51.2,53.55 51.2,46.62 v50.89,46.31 | R36.2 13.78,13.77 | R37.2 12.51,16.3 12.12,16.69 12.12,25.86 v11.54,26.44 | U$1.2 22.12,5.67 19.26,2.81 v16.27,2.81
  Bottom 0.406: v21.66,21.66 C21.2 21.33,19.91 U5.8 19.14,18.12 | 19.14,18.12 14.41,18.12 13.55,17.26 R37.2 R36.2 13.43,14.12 v9.49,14.12 | 13.78,13.77 v13.78,12.62 | v19.13,17.01 19.13,18.11 19.14,18.12
+3V3_ANALOG  (via drill 0.35)
  Top 0.305: R2.1 10.9,22.75 12.18,21.47 U1.39 12.2,20.67 12.2,19.91 11.26,18.97 10.29,18.97 9.69,19.57 6.67,19.57 4.49,21.75 2.82,21.75 2.1,22.47 RT1.2 | C3.1 R2.1 | U6.1 42.21,64.87 44.82,64.87 45.79,63.9 45.79,62.67 47.12,61.34 48.38,61.34 49.91,59.81 49.91,50.29 52.2,48 T2_+.1 | v50.19,45.58 48.07,43.46 40.83,43.46 37.79,40.42 37.79,32.91 31.23,26.35 12.59,26.35 11.93,25.69 11.93,24.08 10.9,23.05 R2.1
  Bottom 0.305: T2_+.1 51.08,45.58 v50.19,45.58
+5V
  Top 0.305: F3.2 59.3,57.65 59.3,42.19 58.39,41.28 45.97,41.28 44.4,39.71 C8.+
  Top 0.813: C8.+ 43.3,24.7 IC4.4 IC4.2 38.11,17.12 37.01,16.02 31.66,16.02 29.18,18.5 IC6.3
+6V
  Top 0.305: L2.2 36.7,3.45 C16.2 37.68,3.45 38.36,2.77 38.36,0.76 38.72,0.4 41.1,0.4 41.45,0.75 R23.1 41.88,1.5 43.25,2.87 F2.1
+12V  (via drill 0.35)
  Top 0.305: U4.3 35,5.55 C15.2 33.63,5.76 | VBUS.3 24.63,4.36 32.23,4.36 33.63,5.76 | L1.2 45.55,12.3 46.82,12.3 49.15,9.97 49.15,7.23 49.93,6.45 R26.2 | v40.22,21.52 40.22,18.24 40.41,18.05 | K1.1 45.22,51.5 v50.05,46.67 | C7.+ 36.61,9.72 34.12,9.72 33.63,9.23 33.63,5.76
  Top 0.813: 45.55,12.3 44.98,12.87 C7.+ 40.41,13.52 40.41,18.05 IC4.3
  Bottom 0.305: D3.C 13.38,34.18 40.22,34.18 | 40.22,34.18 v40.22,21.52 | v50.05,46.67 49.61,46.23 49.61,45.22 50.14,44.69 50.14,36.49 47.83,34.18 40.22,34.18
  Bottom 0.61: D3.C K2.1 | D2.C K1.1
BUS_DATA  (via drill 0.35)
  Top 0.305: R3.2 23.05,11.5 R4.2 | R8.1 R3.2 | U6.7 48.62,67.68 46.66,69.64 21.01,69.64 | BOW_BUS.1 21.01,69.64 | 8.94,69.64 8.2,68.9 BOW_BUS2.1 | 10.88,69.64 8.94,69.64 | 10.88,69.64 21.01,69.64 | JP1.1 10.96,69.56 10.88,69.64 | 8.94,69.64 1.12,69.64 0.36,68.88 0.36,33.51 3.24,30.63 v3.91,30.63 | v19.5,11.35 19.5,10.01 19.91,9.6 R3.2
  Bottom 0.305: v3.91,30.63 4.99,29.55 4.99,17.43 9.1,13.32 11.78,13.32 13.75,11.35 v19.5,11.35
CHG_PRSNT  (via drill 0.35)
  Top 0.305: v18.21,52.13 17.53,52.13 17.12,51.72 17.12,36.48 15.35,34.71 14.44,34.71 13.92,34.19 v13.92,32.51 | U1.42 9.78,21.79 v9.9,21.91
  Bottom 0.305: R20.2 19.53,51.18 R19.1 19.2,51.14 v18.21,52.13 | v13.92,32.51 13.92,31.39 9.9,27.37 v9.9,21.91
CHG_PWR_EN  (via drill 0.35)
  Top 0.305: v12.94,18.46 12.94,12.39 10.58,10.03 U1.15
  Bottom 0.305: R31.1 12.94,26.39 v12.94,18.46
GND  (via drill 0.35)
  other vias: 23.2,24.84 7.97,26.48 42.49,5.66 33.31,0.93
  pour Top (rank 6): 0,0 60,0 60,23 60,70 0,70
  pour Bottom (rank 6): 0,0 60,0 60,70 0,70
  pour Bottom (no thermals): 29.52,58.4 37.95,58.4 37.95,69.98 29.52,69.98
MIDPOINT_V
  Top 0.203: 40.94,67.27 40.87,67.27 39.58,65.98
  Top 0.305: 40.94,67.27 44.89,67.27 U6.5 46.29,66.08 48.54,63.83 48.54,63.14 49.29,62.39 51.59,62.39 52.63,61.35 52.63,59.22 55.85,56 MIDPOINT_V?.1 | 39.58,65.98 39.54,65.94 39.54,59.79 35.34,55.59 35.34,48.34 34.22,47.22 34.22,46.7 34.74,46.18 34.74,33.8 30.67,29.73 3.64,29.73 0.75,26.84 0.75,20.59 1.44,19.9 R25.2
MOT_PWR_EN  (via drill 0.35)
  Top 0.305: v9.17,29.17 9.24,29.1 30.71,29.1 35.29,33.68 35.29,46.66 v34.86,47.09 | U1.14 9.78,10.32 11.37,11.91 11.37,16.81 v9.17,19.01
  Bottom 0.305: v9.17,29.17 v9.17,19.01 | v34.86,47.09 33.56,47.09 R30.2
N$1
  Top 0.305: R1.1 18.11,20.73 17.03,21.81 15.59,21.81 15.38,21.6 U1.35 15.38,19.47 15.96,18.89 15.96,10.78 17.25,9.49 17.95,9.49 18.93,8.51 18.93,3.73 20.69,1.97 30.57,1.97 U$1.5
N$2
  Top 0.305: U1.34 16.18,19.55 16.54,19.19 16.54,10.88 17.37,10.05 18.3,10.05 19.55,8.8 19.55,3.98 20.43,3.1 26.62,3.1 U$1.1
N$3
  Top 0.813: F1.1 D1.C
N$4
  Top 0.305: U1.37 13.78,22.17 C5.1 13.35,23.3 U$2.1
N$5
  Top 0.305: U1.36 14.58,21.74 15.12,22.28 15.96,22.28 16.38,22.7 16.38,23.89 17.39,24.9 U$2.3 19.55,24.9 C4.2
N$6
  Top 0.305: VBUS.2 22.32,5.75 23.05,6.48 R8.2
N$7
  Top 0.305: U2.7 53.37,12.23 53.2,12.4 53.2,14.25 C19.1
N$8
  Bottom 0.2: R13.2 48.63,53.99 48.63,56.47
  Bottom 0.305: R14.1 R13.2 | 48.63,56.47 48.63,57.19 50.25,58.81 U3.4
N$10
  Top 0.305: U4.4 38.85,4.33 R22.2 39.53,1.52 R23.2
N$11
  Bottom 0.305: R17.1 35.44,57.7 R15.P$1
  pour Bottom (isolate 0.254, rank 2, no thermals): 24.43,68.85 24.43,54.35 37.83,54.35 37.83,58.37 29.53,58.37 29.53,68.85
N$12
  Top 0.305: R3.1 24.52,9.6 25.48,10.56 T1.3
N$14
  Bottom 0.305: C13.2 R17.2 43.35,57.7 C12.1 43.81,58.16 U3.10
N$15
  pour Bottom (isolate 0.254, rank 2, no thermals): 12.08,63.9 17.61,63.9 17.61,49.84 24.99,49.84 24.99,45.85 12.08,45.85
N$16
  Bottom 0.305: C14.2 R18.2 41,59.75 C12.2 43.5,60.4 44.36,61.26 46.97,61.26 47.34,60.89 47.34,58.38 46.64,57.68 46.1,57.68 U3.9
N$17
  Top 0.305: U2.2 51.35,12.23 51.6,12.48 C20.1
N$18
  pour Top (isolate 0.254, rank 2, no thermals): 17.61,63.91 25.1,63.91 25.1,54 31.29,54 31.29,33.93 17.61,33.93
N$19
  Top 0.305: JP1.2 13.65,67.75 CHG_TEMP.1
N$20
  Top 0.61: LIGHT_BACK_+.1 46.6,7.65 F2.2
  Bottom 0.305: LIGHT_FRONT_+.1 53.5,23.97 57.09,20.38 57.09,13.39 LIGHT_BACK_+.1
N$21
  Top 0.305: F3.1 57.07,63.72 C18.2 53.78,63.54 U6.8 49.69,63.54 47.53,65.7 47.53,67.61 46.15,68.99 38.23,68.99 37.58,68.34 37.58,65.42 36,63.84 6.04,63.84 DISP_PWR.1
N$22
  Top 0.305: D5.C 49.66,14.91 C20.2
  Top 0.406: D5.C 49.66,13.1 U2.1
  Top 0.813: D5.C 47.72,16.4 L1.1
N$23
  Top 0.305: R7.1 23.2,16.05 T2.1
N$24
  Top 0.305: R27.2 R26.1 55.56,8.91 55.56,10.64 55.27,10.94 U2.5
N$25
  Top 0.305: T1.1 29.42,10.73 R6.1 30.46,11.8 27.8,14.46 T2.3
N$26
  Top 0.305: C17.1 39.4,7.45 U4.6
N$27
  Top 0.305: U2.3 51.68,11.57 52.75,10.5 R28.2
N$28
  Top 0.305: L2.1 36.01,4.66 37.03,4.66 37.59,5.22 37.59,6.47 | C17.2 40.64,8.11 38.12,8.11 37.59,7.58 37.59,6.47 | 37.59,6.47 37.56,6.5 U4.2
N$29  (via drill 0.35)
  Top 0.305: v10.57,21.89 11.1,21.89 11.38,21.61 U1.40 | R43.2 R25.1 4.05,19.7 v5.64,19.7
  Bottom 0.305: v10.57,21.89 10.57,21.66 9.9,20.99 9.9,18.82 9.51,18.43 6.91,18.43 v5.64,19.7
N$30
  Top 0.305: R29.1 59.2,16.82 59.2,14.1 58.9,13.8 57.07,13.8 55.9,12.63 55.9,12.1 55.37,11.57 U2.6
N$31
  Bottom 0.305: R30.1 35.31,49.05 37.81,46.55 Q1.1 39.45,46.55 40.05,47.15 R32.1
N$32
  Bottom 0.305: Q1.3 35.6,50.65 D2.A
  Bottom 0.61: D2.A K1.2
N$33  (via drill 0.35)
  Top 0.305: R38.1 16.18,6.17 U1.22 16.2,9.11 16.2,9.87 15.2,10.87 v15.2,12.63
  Bottom 0.305: U5.3 24.88,15.59 21.92,12.63 v15.2,12.63
N$34
  Bottom 0.305: Q2.3 16.1,30.95 D3.A
  Bottom 0.61: D3.A K2.2
N$35
  Bottom 0.305: R33.1 Q2.1 17.78,27.45 15.89,29.34 R31.2
N$36
  Top 0.305: R34.1 12.07,3.68 LED2.A
N$37  (via drill 0.35)
  Top 0.305: U1.29 v19.15,15.69 v19.16,15.68
  Bottom 0.305: U5.6 21.23,15.68 v19.16,15.68 16.99,15.68 16.37,16.3 R37.1
N$38
  Top 0.305: R35.1 9.4,3.42 8.05,2.07 LED1.A
N$39
  Top 0.305: R35.2 9.4,6.97 9.93,7.5 10.93,7.5 11.38,7.95 U1.16
N$40
  Top 0.305: U1.17 12.18,7.63 11.6,7.05 R34.2
N$41  (via drill 0.35)
  Top 0.305: U1.28 18.89,14.89 v19.16,14.62
  Bottom 0.305: U5.5 19.46,14.31 v19.16,14.62 16.99,14.62 16.37,14 R36.1
N$42
  Bottom 0.305: U5.1 29.36,18.12 Q3.P$1 30.08,18.94 C22.2
N$43
  Bottom 0.305: U5.2 29.66,16.86 Q3.P$2 30.09,16.35 C23.2
PACK_TEMP  (via drill 0.35)
  Top 0.305: U1.43 8.98,21.62 8.74,21.86 v6.89,21.86 6.7,22.05 R40.2 | U6.2 42.27,61.41 35.77,54.91 35.77,33.51 30.86,28.6 7.11,28.6 v6.89,28.82 | T2_-.1 55.74,46.24 52.14,46.24 48.9,49.48 v48.9,58.98
  Bottom 0.305: v6.89,28.82 v6.89,21.86 | v48.9,58.98 48.62,58.98 48,59.6 48,61.33 47.54,61.79 44.02,61.79 U6.2
PCB_TEMP
  Top 0.305: RT1.1 2.51,24.85 3.23,24.13 3.23,23.66 3.94,22.95 R41.2 6.86,20.69 U1.44
RX
  Top 0.305: U1.32 18.9,18.09 19.84,17.15 19.84,16.34 20.06,16.12 20.06,14.69 20.95,13.8 R5.2 R4.1
SCL  (via drill 0.35)
  Top 0.305: R12.1 4.45,8.99 4.98,9.52 4.98,10.44 5.43,10.89 U1.11 8.55,10.89 9.37,11.71 v9.37,12.54 | v44.81,59.64 43.04,59.64 36.74,53.34 36.74,33.19 31.11,27.56 4.61,27.56 v4.19,27.14
  Bottom 0.305: U3.13 45.28,60.11 v44.81,59.64 | v4.19,27.14 4.19,17.34 8.99,12.54 v9.37,12.54
SDA  (via drill 0.35)
  Top 0.305: R11.1 4.44,11.69 U1.10 8.23,11.69 v8.58,12.04 | v44.8,60.54 42.62,60.54 36.24,54.16 36.24,33.34 31,28.1 4.18,28.1 v3.79,28.49
  Bottom 0.305: U3.14 45.02,60.76 v44.8,60.54 | v3.79,28.49 3.53,28.23 3.53,17.09 v8.58,12.04
T1_+  (via drill 0.35)
  Top 0.305: U6.3 44.25,66.08 46.25,64.08 46.25,63 47.29,61.96 48.54,61.96 50.53,59.97 v50.53,56.83
  Bottom 0.305: v50.53,56.83 50.56,56.86 U3.7 51.73,55.22 C9.1 51.75,53.75 T1_+.1
T1_-  (via drill 0.35)
  Top 0.305: v44.83,58.81 44.9,58.81 45.35,59.26 45.35,61.31 44.81,61.85 U6.4 | v51.4,61.66 51.4,59.49 57.54,53.35 57.54,52.04 T1_-.1
  Bottom 0.305: U3.11 v44.83,58.81 | U6.4 46.09,62.26 50.8,62.26 v51.4,61.66
TX
  Top 0.305: U1.33 19.11,18.89 20.37,17.63 20.37,16.68 R7.2
VBAT
  Top 0.813: D1.A 47.2,39.1 K1.COM
  Bottom 0.305: R14.2 49.57,48.06 47.75,46.24 47.75,45.22
  pour Bottom (isolate 0.254, no thermals): 3.27,63.9 3.27,36.97 48.76,36.97 48.76,45.86 12.03,45.86 12.03,63.9
VCC  (via drill 0.35)
  Top 0.305: C6.+ 54.02,21.9 54.18,21.9 56.75,21.9 R9.2 | VBUS.1 20.8,4.28 v21.28,3.8
  Top 0.508: U2.8 55.02,12.87 v55.86,13.7 57.52,15.36
  Top 0.61: 54.02,21.9 54,21.88 54,19.35 55.64,17.71 R29.2 56.4,16.5 57.44,15.46 D4.C 57.52,15.36
  Top 0.813: F1.2 54.2,21.92 54.18,21.9
  Bottom 0.305: v21.28,3.8 23.28,1.8 39.66,1.8 51.56,13.7 v55.86,13.7
VIN_SENSE  (via drill 0.35)
  Top 0.305: U1.41 v10.59,19.55 | R10.2 R9.1 v55.34,19.95 | v13.82,19.35 12.82,19.35 11.79,18.32 10.67,18.32 v10.59,18.4
  Bottom 0.305: v55.34,19.95 33.22,19.95 30.89,22.28 21.4,22.28 21.38,22.25 16.49,22.25 13.82,19.58 v13.82,19.35 | v10.59,18.4 v10.59,19.55

### Text on the board
tNames: DATA | DATA | CHG- | www.afrobotic.nl | B- | GND | B+ | CHG+ | M+ | M- | T. Ligeon / July 2020 | 5V | V/2 | T1+ | T1- | T2- | T2+ | LF- | LF+ | REV 1.0 | XTAL | LB+ | LB- | 12V | PDI
bNames: CHG- | www.afrobotic.nl | DATA | DATA | B- | B+ | CHG- | M+ | M- | GND | 5V | V/2 | T1+ | T1- | T2+ | T2- | LF+ | LF- | T. Ligeon / July 2020 | LB+ | LB- | REV 1.0
200bmp: C:/Users/thier/Pictures/afroboticSquare.bmp